# EAGLE design writer_attiny10 (EAGLE 6.1)
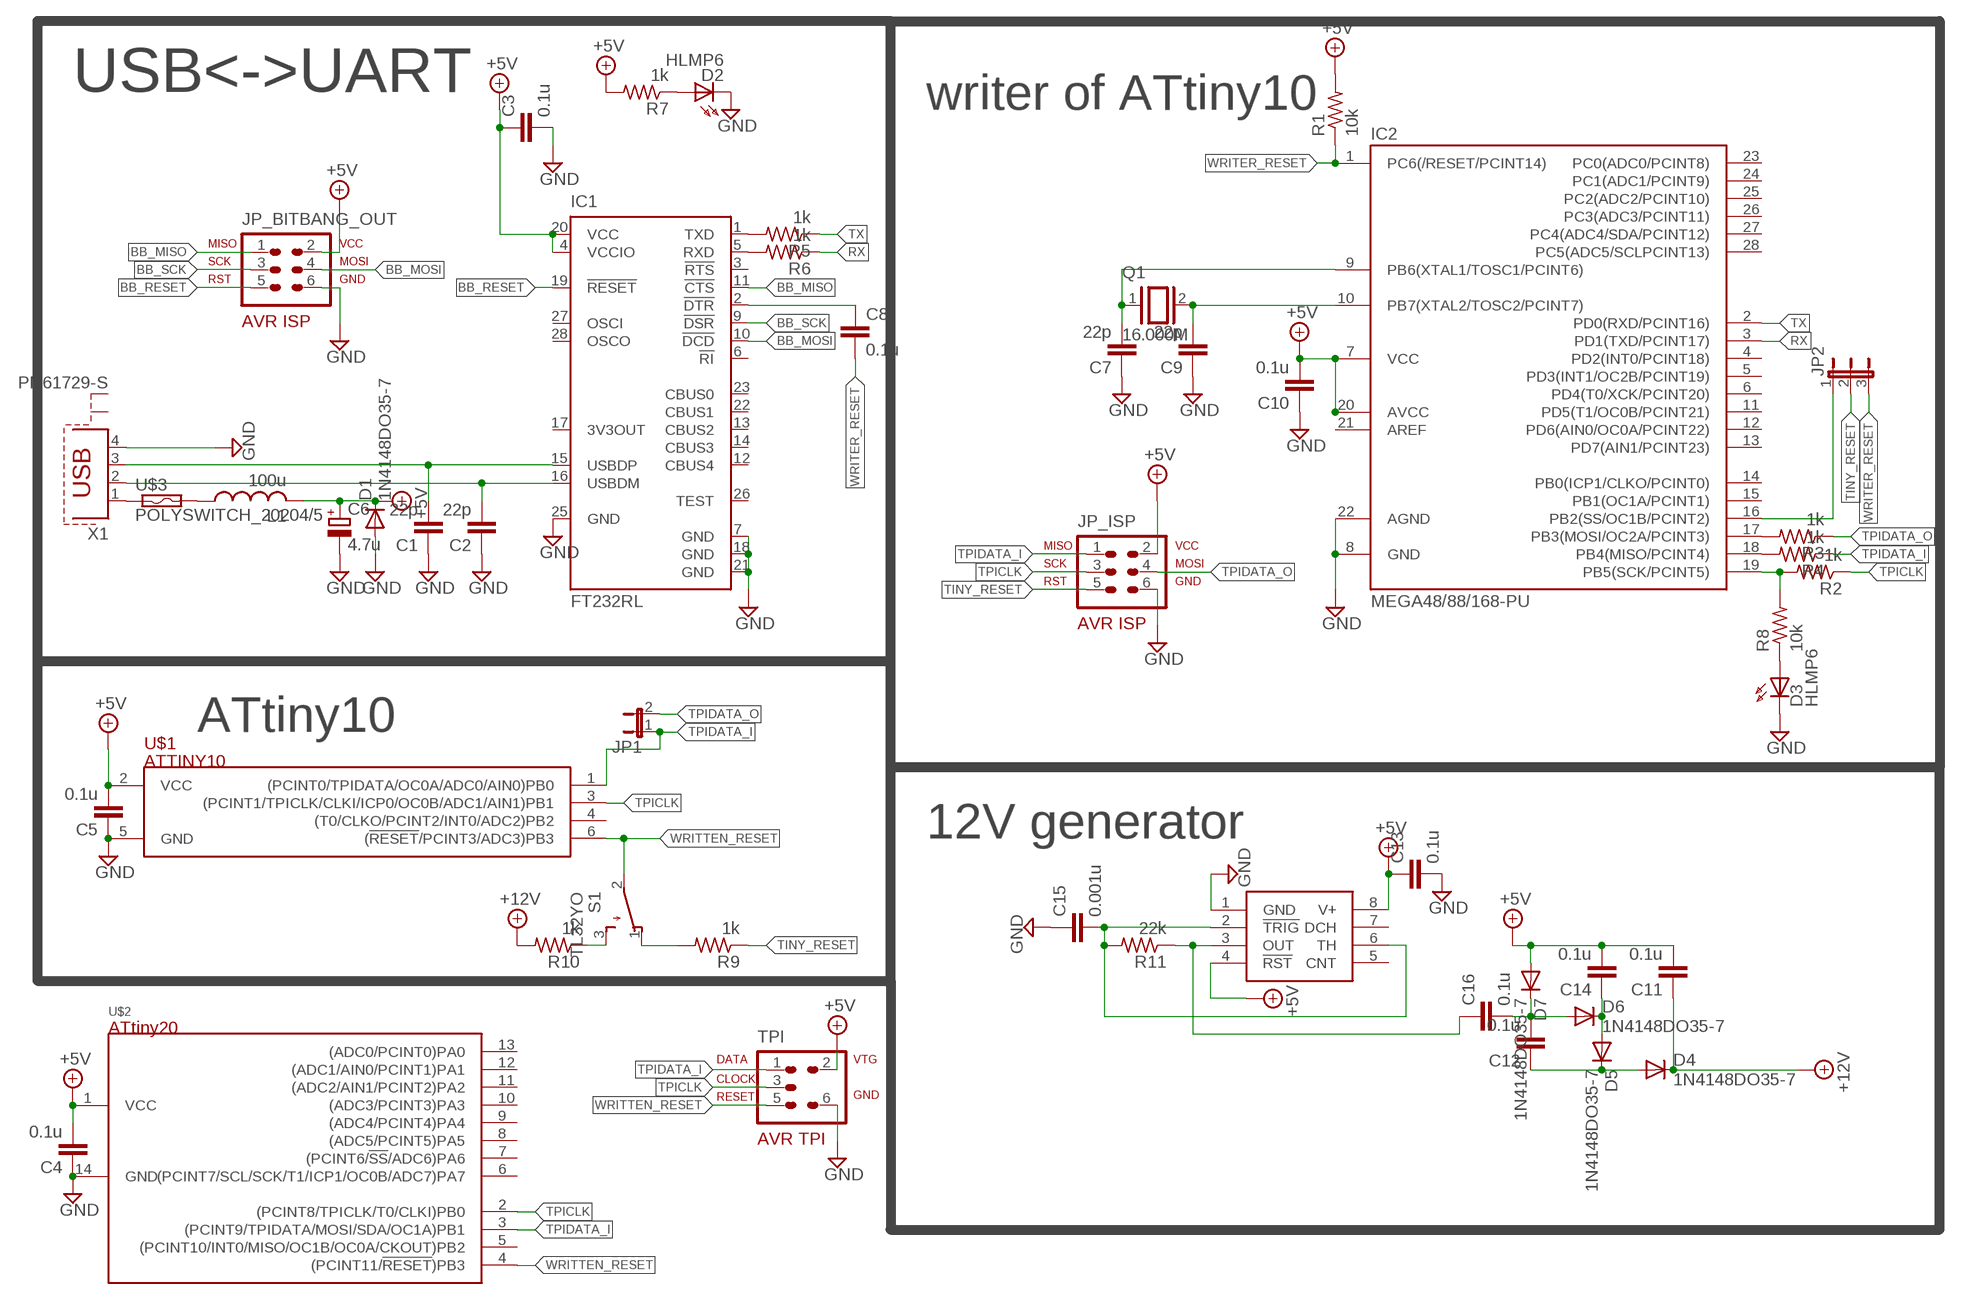
[diagram p0: schematic, sheet 1]

## Parts
C1  22p  C-EUC0603  [C0603]
C2  22p  C-EUC0603  [C0603]
C3  0.1u  C-EUC0603  [C0603]
C4  0.1u  C-EUC0603  [C0603]
C5  0.1u  C-EUC0603  [C0603]
C6  4.7u  CPOL-EUCT3216  [CT3216]
C7  22p  C-EUC0603  [C0603]
C8  0.1u  C-EUC0603  [C0603]
C9  22p  C-EUC0603  [C0603]
C10  0.1u  C-EUC0603  [C0603]
C11  0.1u  C-EUC0603  [C0603]
C12  0.1u  C-EUC0603  [C0603]
C13  0.1u  C-EUC0603  [C0603]
C14  0.1u  C-EUC0603  [C0603]
C15  0.001u  C-EUC0603  [C0603]
C16  0.1u  C-EUC0603  [C0603]
D1  1N4148DO35-7  [DO35-7]
D2  HLMP6  [HLMP6]
D3  HLMP6  [HLMP6]
D4  1N4148DO35-7  [DO35-7]
D5  1N4148DO35-7  [DO35-7]
D6  1N4148DO35-7  [DO35-7]
D7  1N4148DO35-7  [DO35-7]
IC1  FT232RL  [SSOP28]
IC2  MEGA48/88/168-PU  [DIL28-3]
IC3  LMC555  [DIL08]
JP1  JP1E  [JP1]
JP2  JP2E  [JP2]
JP_BITBANG_OUT  AVR-ISP-6VERT  [AVR-ISP-6]
JP_ISP  AVR-ISP-6VERT  [AVR-ISP-6]
L1  100u  L-US0207/10  [0207/10]
Q1  16.000M  XTAL/S  [QS]
R1  10k  R-US_R0603  [R0603]
R2  1k  R-US_R0603  [R0603]
R3  1k  R-US_R0603  [R0603]
R4  1k  R-US_R0603  [R0603]
R5  1k  R-US_R0603  [R0603]
R6  1k  R-US_R0603  [R0603]
R7  1k  R-US_R0603  [R0603]
R8  10k  R-US_R0603  [R0603]
R9  1k  R-US_R0603  [R0603]
R10  1k  R-US_R0603  [R0603]
R11  22k  R-US_R0603  [R0603]
S1  TL32YO  [TL3XYO]
TPI  AVR-TPIVERT  [AVR-ISP-6]
U$1  ATTINY10  [SOT-23]
U$2  ATTINY20  [SOIC14]
U$3  POLYSWITCH_20204/5  [0204/5]
X1  PN61729-S  [PN61729-S]

## Nets
+5V [pwr]: C3.1 C4.2 C5.2 C6.+ C10.2 C11.2 C13.1 C14.2 D1.C D7.A IC1.4(VCCIO) IC1.20(VCC) IC2.7(VCC) IC2.20(AVCC) IC3.4(!RST) IC3.8(V+) JP_BITBANG_OUT.2 JP_ISP.2 L1.2 R1.2 R7.2 TPI.2 U$1.2(VCC) U$2.1(VCC)
+12V: C11.1 D4.C R10.2
BB_MISO: IC1.11(!CTS) JP_BITBANG_OUT.1
BB_MOSI: IC1.10(!DCD) JP_BITBANG_OUT.4
BB_RESET: IC1.19(!RESET) JP_BITBANG_OUT.5
BB_SCK: IC1.9(!DSR) JP_BITBANG_OUT.3
GND: C1.1 C2.1 C3.2 C4.1 C5.1 C6.- C7.1 C9.1 C10.1 C13.2 C15.1 D1.A D2.K D3.K IC1.7(GND) IC1.18(GND) IC1.21(GND) IC1.25(GND) IC2.8(GND) IC2.22(AGND) IC3.1(GND) JP_BITBANG_OUT.6 JP_ISP.6 TPI.6 U$1.5(GND) U$2.14(GND) X1.4
N$1: C2.2 IC1.16(USBDM) X1.2
N$2: C1.2 IC1.15(USBDP) X1.3
N$3 [pwr]: U$3.1 X1.1
N$4: C7.2 IC2.9(PB6(XTAL1/TOSC1/PCINT6)) Q1.1
N$5: C9.2 IC2.10(PB7(XTAL2/TOSC2/PCINT7)) Q1.2
N$6: IC2.18(PB4(MISO/PCINT4)) R4.2
N$7: D2.A R7.1
N$8: D3.A R8.1
N$9: IC1.5(RXD) R6.2
N$10: C12.2 C16.2 D6.A D7.C
N$11: IC1.1(TXD) R5.2
N$12: C15.2 IC3.2(!TRIG) IC3.6(TH) R11.2
N$13: C16.1 IC3.3(OUT) R11.1
N$14: C14.1 D5.A D6.C
N$15: C12.1 D4.A D5.C
N$16: R10.1 S1.3(S)
N$17: R9.2 S1.1(O)
N$18 [pwr]: L1.1 U$3.2
N$19: IC2.17(PB3(MOSI/OC2A/PCINT3)) R3.2
N$20: IC2.16(PB2(SS/OC1B/PCINT2)) JP2.1
N$21: C8.1 IC1.2(!DTR)
N$22: IC2.19(PB5(SCK/PCINT5)) R2.2 R8.2
RX: IC2.3(PD1(TXD/PCINT17)) R6.1
TINY_RESET: JP2.2 JP_ISP.5 R9.1
TPICLK: JP_ISP.3 R2.1 TPI.3 U$1.3((PCINT1/TPICLK/CLKI/ICP0/OC0B/ADC1/AIN1)PB1) U$2.2((PCINT8/TPICLK/T0/CLKI)PB0)
TPIDATA_I: JP1.1 JP_ISP.1 R4.1 TPI.1 U$1.1((PCINT0/TPIDATA/OC0A/ADC0/AIN0)PB0) U$2.3((PCINT9/TPIDATA/MOSI/SDA/OC1A)PB1)
TPIDATA_O: JP1.2 JP_ISP.4 R3.1
TX: IC2.2(PD0(RXD/PCINT16)) R5.1
WRITER_RESET: C8.2 IC2.1(PC6(/RESET/PCINT14)) JP2.3 R1.1
WRITTEN_RESET: S1.2(P) TPI.5 U$1.6((!RESET!/PCINT3/ADC3)PB3) U$2.4((PCINT11/!RESET!)PB3)
Unconnected: IC1.3(!RTS) IC1.6(!RI) IC1.12(CBUS4) IC1.13(CBUS2) IC1.14(CBUS3) IC1.17(3V3OUT) IC1.22(CBUS1) IC1.23(CBUS0) IC1.26(TEST) IC1.27(OSCI) IC1.28(OSCO) IC2.4(PD2(INT0/PCINT18)) IC2.5(PD3(INT1/OC2B/PCINT19)) IC2.6(PD4(T0/XCK/PCINT20)) IC2.11(PD5(T1/OC0B/PCINT21)) IC2.12(PD6(AIN0/OC0A/PCINT22)) IC2.13(PD7(AIN1/PCINT23)) IC2.14(PB0(ICP1/CLKO/PCINT0)) IC2.15(PB1(OC1A/PCINT1)) IC2.21(AREF) IC2.23(PC0(ADC0/PCINT8)) IC2.24(PC1(ADC1/PCINT9)) IC2.25(PC2(ADC2/PCINT10)) IC2.26(PC3(ADC3/PCINT11)) IC2.27(PC4(ADC4/SDA/PCINT12)) IC2.28(PC5(ADC5/SCLPCINT13)) IC3.5(CNT) IC3.7(DCH) U$1.4((T0/CLKO/PCINT2/INT0/ADC2)PB2) U$2.5((PCINT10/INT0/MISO/OC1B/OC0A/CKOUT)PB2) U$2.6((PCINT7/SCL/SCK/T1/ICP1/OC0B/ADC7)PA7) U$2.7((PCINT6/!SS!/ADC6)PA6) U$2.8((ADC5/PCINT5)PA5) U$2.9((ADC4/PCINT4)PA4) U$2.10((ADC3/PCINT3)PA3) U$2.11((ADC2/AIN1/PCINT2)PA2) U$2.12((ADC1/AIN0/PCINT1)PA1) U$2.13((ADC0/PCINT0)PA0) X1.S1 X1.S2

## Notes on the sheet
- USB<->UART
- writer of ATtiny10
- ATtiny10
- 12V generator

## Library data of the parts
C1-C5 C7-C16 = rcl:C-EU: CAPACITOR, European symbol
C6 = rcl:CPOL-EU: POLARIZED CAPACITOR, European symbol
D1 D4-D7 = diode:1N4148: DIODE high speed (Philips)
D2 D3 = display-hp:HLMP6: LED 2mm horizontal; MF: AGILENT TECHNOLOGIES; MPN: HLMP-6500; OC_FARNELL: 1652490; OC_NEWARK: 40K0088
IC1 = ftdichip:FT232R: Source: http://www.ftdichip.com/Documents/DataSheets/DS_FT232R_v104.pdf; MPN: FT232RL; OC_FARNELL: 1146032; OC_NEWARK: 91K9918
IC2 = avr-7:MEGA48/88/168-PU
IC3 = myparts:LMC555
JP1 = jumper:JP1E: JUMPER
JP2 = jumper:JP2E: JUMPER
JP_BITBANG_OUT JP_ISP = avr-7:AVR-ISP-6: AVR ISP-6 Serial Programming Header
L1 = resistor:L-US: INDUCTOR, American symbol
Q1 = special:XTAL/S: CRYSTAL
R1-R11 = resistor:R-US_: RESISTOR, American symbol
S1 = switch:TL32YO: TINY SWITCH ON - MOM Source: http://www2.produktinfo.conrad.com/datenblaetter/700000-724999/705152-da-01-de-Subminiaturschalter_TL_36YO.pdf
TPI = avr-7:AVR-TPI: AVR TPI connector
U$1 = myparts:ATTINY10
U$2 = myparts:ATTINY20; SSU: -SSU
U$3 = myparts:POLYSWITCH_2
X1 = con-berg:PN61729-S: BERG USB connector; OC_FARNELL: unknown; OC_NEWARK: unknown

## Net classes
0 default: width 0.254 mm
1 pwr: width 0.508 mm

## Board
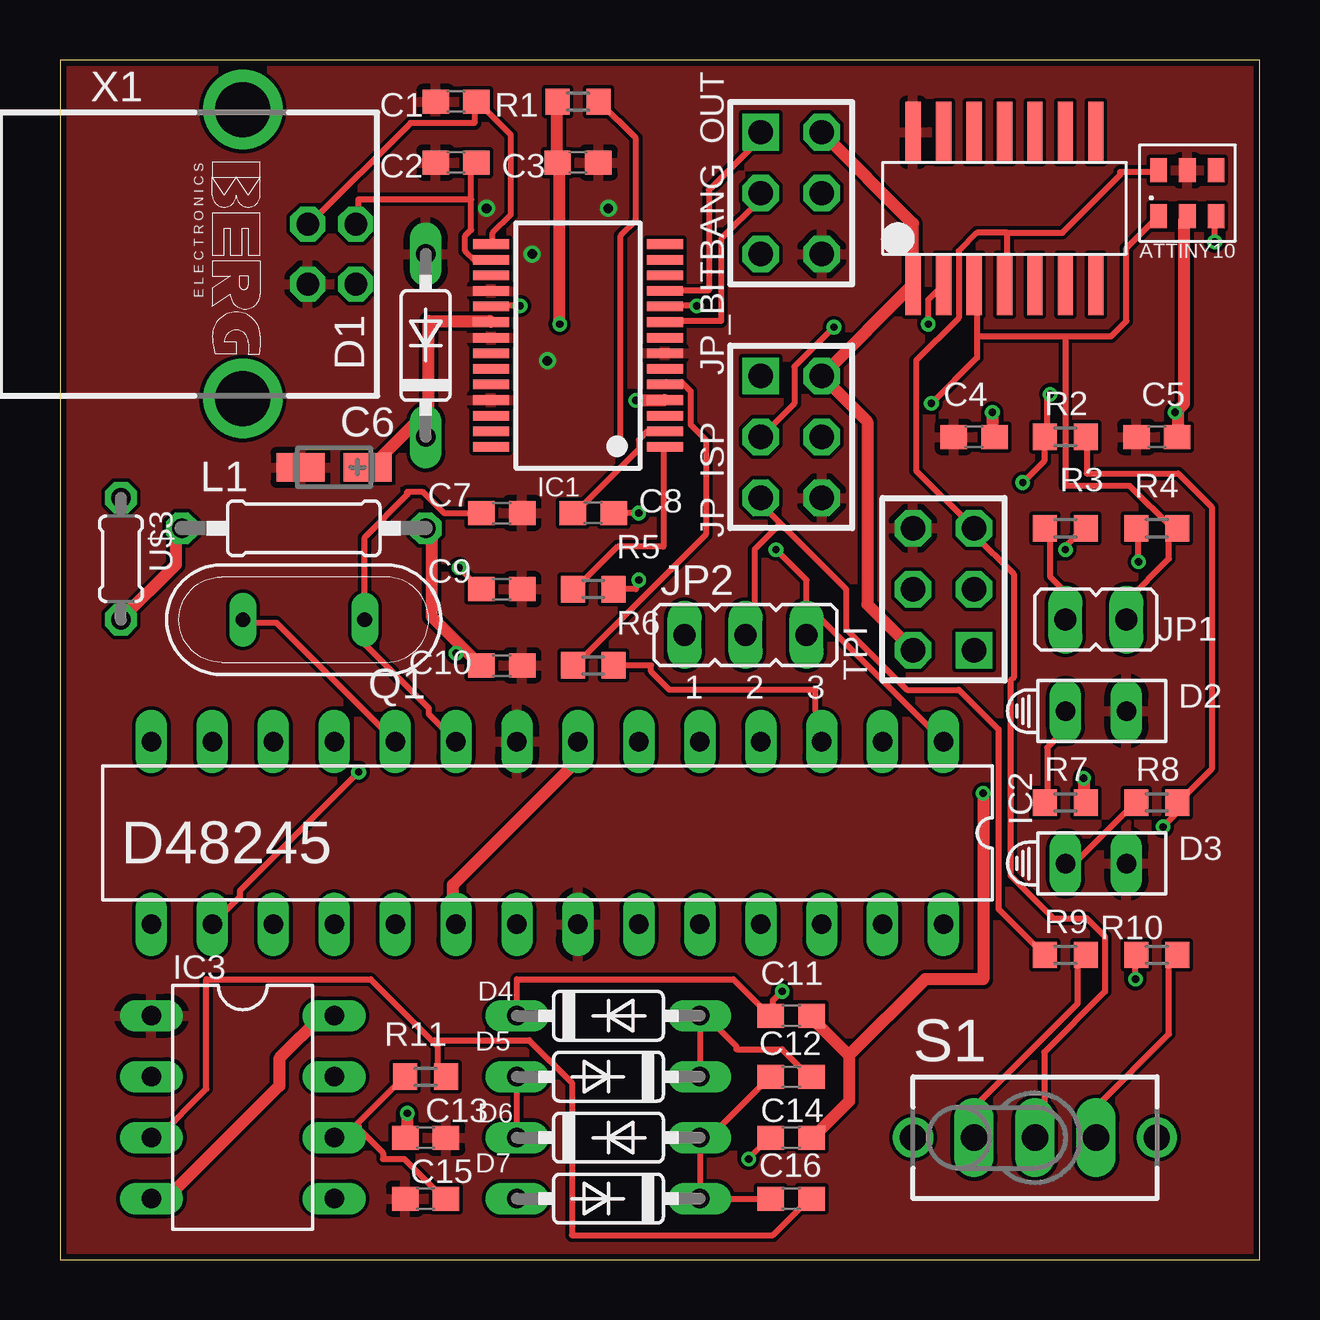
[diagram p1: board, top side]
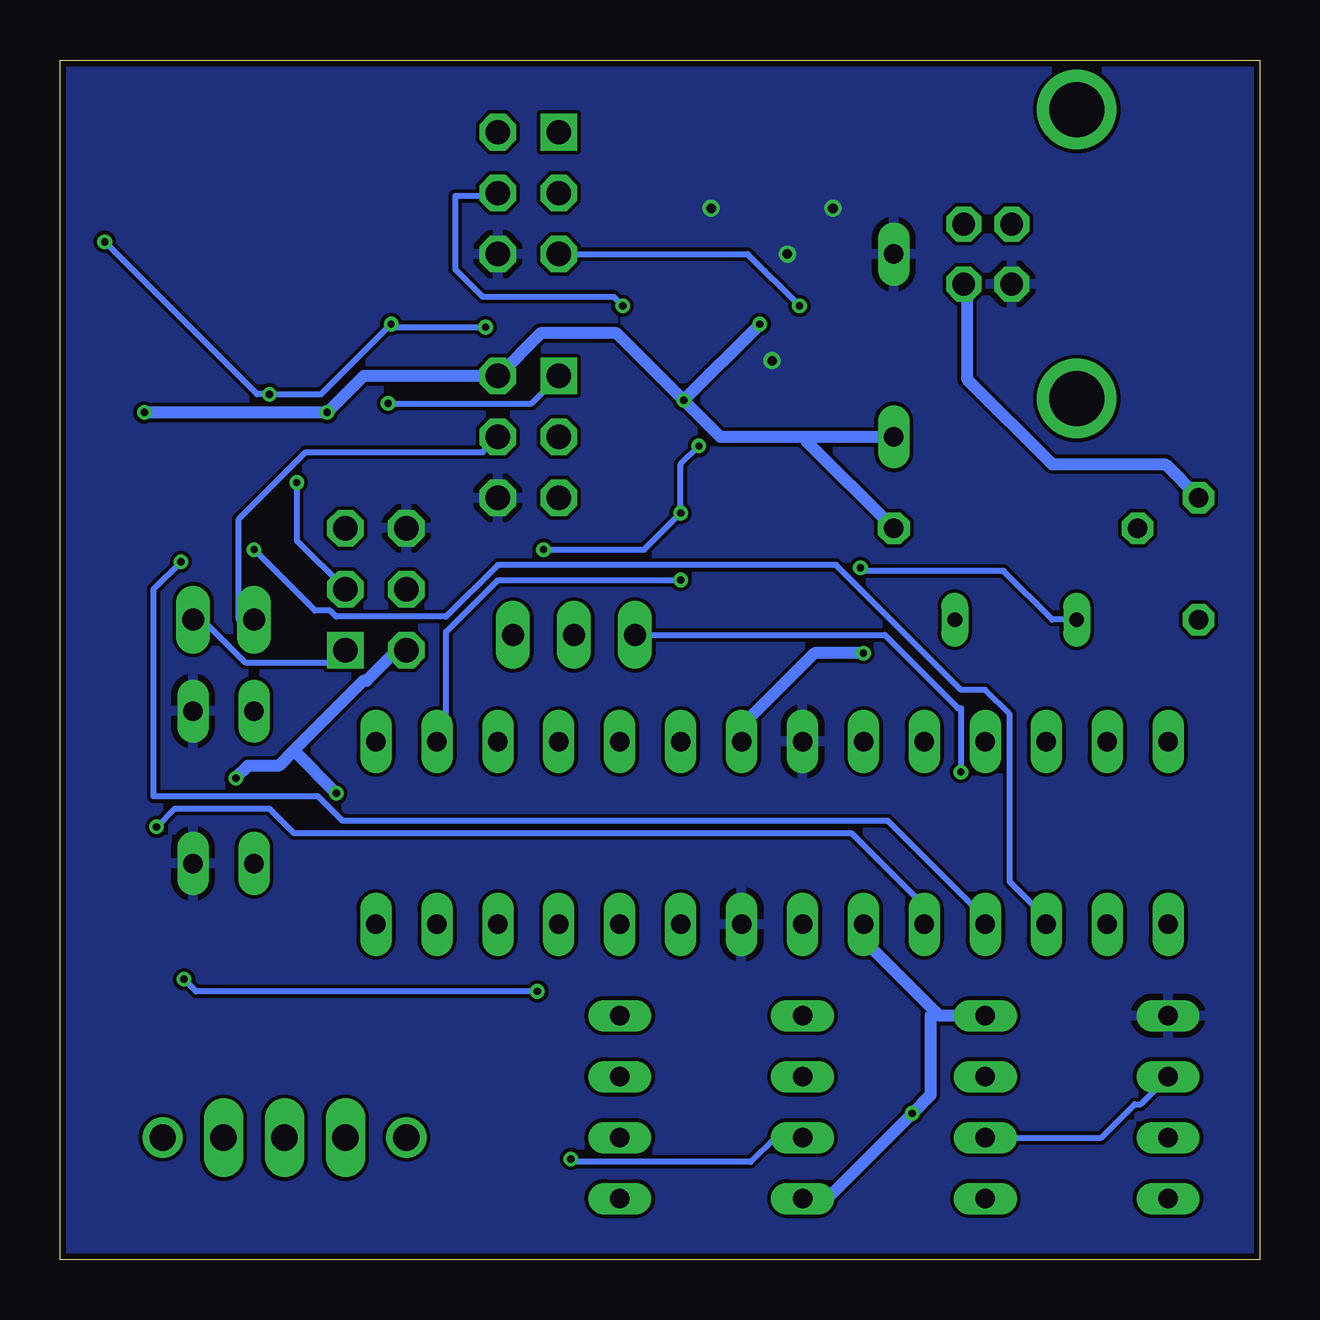
[diagram p2: board, bottom side, seen from below]

Size 50 x 50 mm. Coordinates in mm from the lower left corner, seen from the top.
Outline: 0,0 50,0 50,50 0,50 0,0
Copper layers (1*16): Top 0.035mm / dielectric 1.5mm / Bottom 0.035mm
Design rules: minimum track width 6mil, minimum drill 12mil, track to track 6mil, track to pad 6mil, pad to pad 6mil, via to via 6mil, smd to smd 0mil, copper to edge 10mil, drill to drill 10mil, minimum pad ring 10mil, minimum via ring 6mil, stop-mask expansion 2mil, vias tented up to drill 100mil, thermal gap 10mil

### Footprints (pad centres in the part's own frame; a part is rotated, then mirrored left to right if it is on the bottom)
C0603 = smd 1.1 x 1: 1 -0.85,0; 2 0.85,0
CT3216 = smd 2 x 1.2: + -1.4,0; - 1.4,0
DO35-7 = drill 0.813 long: A 3.81,0; C -3.81,0
HLMP6 = drill 0.813 long: A -1.27,0; K 1.27,0
SSOP28 = smd 0.4 x 1.5: 1 -4.225,-3.625; 2 -3.575,-3.625; 3 -2.925,-3.625; 4 -2.275,-3.625; 5 -1.625,-3.625; 6 -0.975,-3.625; 7 -0.325,-3.625; 8 0.325,-3.625; 9 0.975,-3.625; 10 1.625,-3.625; 11 2.275,-3.625; 12 2.925,-3.625; 13 3.575,-3.625; 14 4.225,-3.625; 15 4.225,3.625; 16 3.575,3.625; 17 2.925,3.625; 18 2.275,3.625; 19 1.625,3.625; 20 0.975,3.625; 21 0.325,3.625; 22 -0.325,3.625; 23 -0.975,3.625; 24 -1.625,3.625; 25 -2.275,3.625; 26 -2.925,3.625; 27 -3.575,3.625; 28 -4.225,3.625
DIL28-3 = drill 0.813 long: 1 -16.51,-3.81; 2 -13.97,-3.81; 3 -11.43,-3.81; 4 -8.89,-3.81; 5 -6.35,-3.81; 6 -3.81,-3.81; 7 -1.27,-3.81; 8 1.27,-3.81; 9 3.81,-3.81; 10 6.35,-3.81; 11 8.89,-3.81; 12 11.43,-3.81; 13 13.97,-3.81; 14 16.51,-3.81; 15 16.51,3.81; 16 13.97,3.81; 17 11.43,3.81; 18 8.89,3.81; 19 6.35,3.81; 20 3.81,3.81; 21 1.27,3.81; 22 -1.27,3.81; 23 -3.81,3.81; 24 -6.35,3.81; 25 -8.89,3.81; 26 -11.43,3.81; 27 -13.97,3.81; 28 -16.51,3.81
DIL08 = drill 0.813 long: 1 -3.81,-3.81; 2 -1.27,-3.81; 3 1.27,-3.81; 4 3.81,-3.81; 5 3.81,3.81; 6 1.27,3.81; 7 -1.27,3.81; 8 -3.81,3.81
JP1 = drill 0.914 long: 1 0,-1.27; 2 0,1.27
JP2 = drill 0.914 long: 1 -2.54,0; 2 0,0; 3 2.54,0
AVR-ISP-6 = drill 1.016 square: 1 -2.54,-1.27 | drill 1.016 octagon: 2 -2.54,1.27; 3 0,-1.27; 4 0,1.27; 5 2.54,-1.27; 6 2.54,1.27
0207/10 = drill 0.813 octagon: 1 -5.08,0; 2 5.08,0
QS = drill 0.61 long: 1 -2.54,0; 2 2.54,0
R0603 = smd 1 x 1.1: 1 -0.85,0; 2 0.85,0
TL3XYO = drill 1.1 pad 1.422 long: 1 -2.54,0; 2 0,0; 3 2.54,0 | drill 1.1 pad 1.676: M1 -5.08,0; M2 5.08,0
SOT-23 = smd 0.7 x 1: 1 -1.2,-0.95; 2 0,-0.95; 3 1.2,-0.95; 4 1.2,0.95; 5 0,0.95; 6 -1.2,0.95
SOIC14 = smd 2.54 x 0.635: 1 -2.54,3.81; 2 -2.54,2.54; 3 -2.54,1.27; 4 -2.54,0; 5 -2.54,-1.27; 6 -2.54,-2.54; 7 -2.54,-3.81; 8 3.81,-3.81; 9 3.81,-2.54; 10 3.81,-1.27; 11 3.81,0; 12 3.81,1.27; 13 3.81,2.54; 14 3.81,3.81
0204/5 = drill 0.813 octagon: 1 -2.54,0; 2 2.54,0
PN61729-S = drill 0.95 octagon: 1 1.25,4.71; 2 -1.25,4.71; 3 -1.25,2.71; 4 1.25,2.71 | drill 2.3 pad 2.9: S1 -6.02,0; S2 6.02,0

### Placement (x,y rotation side)
C1  16.51,48.26 0 top
C2  16.51,45.72 0 top
C3  21.59,45.72 0 top
C4  38.1,34.29 0 top
C5  45.72,34.29 0 top
C6  11.43,33.02 180 top
C7  18.41,31.11 180 top
C8  22.23,31.11 0 top
C9  18.41,27.94 180 top
C10  18.41,24.77 180 top
C11  30.48,10.16 0 top
C12  30.48,7.62 180 top
C13  15.24,5.08 0 top
C14  30.48,5.08 0 top
C15  15.24,2.54 0 top
C16  30.48,2.54 180 top
D1  15.24,38.1 90 top
D2  43.18,22.86 0 top
D3  43.18,16.51 0 top
D4  22.86,10.16 0 top
D5  22.86,7.62 180 top
D6  22.86,5.08 0 top
D7  22.86,2.54 180 top
IC1  21.59,38.1 90 top
IC2  20.32,17.78 180 top
IC3  7.62,6.35 270 top
JP1  43.18,26.67 90 top
JP2  28.57,26.04 0 top
JP_BITBANG_OUT  30.48,44.45 270 top
JP_ISP  30.48,34.29 270 top
L1  10.16,30.48 0 top
Q1  10.16,26.67 180 top
R1  21.59,48.26 180 top
R2  41.91,34.29 0 top
R3  41.91,30.48 0 top
R4  45.72,30.48 180 top
R5  22.23,27.94 180 top
R6  22.23,24.77 180 top
R7  41.91,19.05 0 top
R8  45.72,19.05 0 top
R9  41.91,12.7 0 top
R10  45.72,12.7 180 top
R11  15.24,7.62 180 top
S1  40.64,5.08 0 top
TPI  36.83,27.94 90 top
U$1  46.99,44.45 0 top
U$2  39.37,43.18 90 top
U$3  2.54,29.21 270 top
X1  7.62,41.91 270 top

### Tracks (layer width: path | path; a pad name or v marks a point on that pad's centre or on a via)
+5V  (via drill 0.3)
  Top 0.508: v14.48,6.1 14.48,5.08 C13.1 | IC3.4 4.83,2.54 4.83,2.92 9.14,7.24 9.14,8.38 10.92,10.16 IC3.8 | IC2.7 21.21,21.21 21.21,20.45 16.38,15.62 16.38,14.1 IC2.20 | 32.89,8.51 32.89,6.6 31.37,5.08 C14.2 | 32.89,8.51 31.37,10.03 31.37,10.16 C11.2 | v42.67,20.07 42.67,19.05 R7.2 | 32.89,8.51 36.07,11.68 38.48,11.68 v38.48,19.43 | 46.61,35.43 46.86,35.69 46.86,43.31 46.99,43.43 U$1.2 | 46.61,35.43 46.61,34.29 C5.2 | v38.86,35.31 38.86,34.29 C4.2 | JP_BITBANG_OUT.2 35.56,43.18 U$2.1 JP_ISP.2 33.66,34.92 33.66,27.3 TPI.2 | v46.48,35.31 46.61,35.43 | 16.76,25.53 15.49,26.8 15.49,29.97 15.24,30.23 L1.2 | 16.76,25.53 17.53,24.77 C10.2 | R1.2 20.7,48.26 20.7,45.72 C3.1 20.83,45.59 v20.83,38.99 | IC1.20 17.91,39.12 15.37,39.12 15.37,34.42 D1.C 15.24,35.31 12.95,33.02 C6.+ | v24,35.81 25.15,35.81 IC1.4 | v16.51,25.27 16.76,25.53
  Bottom 0.508: D7.A 18.03,2.54 v14.48,6.1 13.72,6.86 13.72,10.16 13.59,10.16 13.46,10.29 | IC2.20 16.51,12.95 16.13,12.95 13.46,10.29 | 13.46,10.29 13.34,10.16 IC3.8 | v42.67,20.07 42.16,20.57 40.89,20.57 40.26,21.21 | 40.26,21.21 37.34,24.13 37.21,24.13 35.94,25.4 TPI.2 | 40.26,21.21 v38.48,19.43 | v46.48,35.31 v38.86,35.31 37.34,36.83 JP_ISP.2 29.97,38.61 26.8,38.61 v24,35.81 | v24,35.81 22.48,34.29 18.92,34.29 | D1.C 18.92,34.29 | v24,35.81 v20.83,38.99 | L1.2 18.92,34.16 18.92,34.29 | IC2.7 21.59,22.61 21.21,22.61 18.54,25.27 v16.51,25.27
+12V  (via drill 0.3)
  Top 0.254: D4.C 19.05,11.68 28.07,11.68 29.59,10.16 C11.1 29.72,10.16 29.72,10.79 v30.1,11.18 | v44.83,11.68 44.83,12.7 R10.2
  Bottom 0.254: v44.83,11.68 44.32,11.18 v30.1,11.18
BB_MISO
  Top 0.254: JP_BITBANG_OUT.1 29.21,46.74 27.05,44.58 27.05,40.39 25.27,40.39 IC1.11
BB_MOSI  (via drill 0.3)
  Top 0.254: v26.54,39.75 25.27,39.75 IC1.10
  Bottom 0.254: v26.54,39.75 26.92,40.13 32.38,40.13 33.53,41.27 33.53,44.32 31.88,44.32 JP_BITBANG_OUT.4
BB_RESET  (via drill 0.3)
  Top 0.254: v19.18,39.75 18.03,39.75 IC1.19
  Bottom 0.254: v19.18,39.75 21.34,41.91 JP_BITBANG_OUT.5
BB_SCK
  Top 0.254: JP_BITBANG_OUT.3 29.21,44.2 27.56,42.55 27.56,39.12 25.27,39.12 IC1.9
GND  (via drill 0.4)
  other vias: 17.78,43.81 22.86,43.81 20.32,37.47 19.68,41.91
  pour Top: -2.54,53.34 -2.54,-2.54 54.61,-2.54 54.61,53.34
  pour Bottom: -1.27,52.07 -1.27,-1.27 52.07,-1.27 52.07,52.07 0,52.07
N$1
  Top 0.254: 17.14,44.2 17.14,42.93 16.89,42.67 16.89,42.04 17.27,41.66 17.91,41.66 IC1.16 | 17.14,44.2 17.14,45.59 17.27,45.72 C2.2 | 17.14,44.2 12.45,44.2 12.45,43.18 X1.2
N$2
  Top 0.254: IC1.15 18.03,42.42 18.03,42.8 18.8,43.56 18.8,46.86 17.4,48.26 C1.2 17.27,48.26 17.27,47.37 14.61,47.37 10.41,43.18 X1.3
N$3
  Bottom 0.508: U$3.1 3.94,33.15 8.64,33.15 12.19,36.7 12.19,40.64 12.32,40.64 X1.1
N$4
  Top 0.254: C7.2 16,31.11 15.11,32 14.48,32 14.48,31.88 12.7,30.1 Q1.1 12.57,26.54 12.57,25.78 15.37,22.99 15.37,22.73 IC2.9
N$5  (via drill 0.3)
  Top 0.254: v16.64,28.83 17.53,27.94 C9.2 | IC2.10 9.02,26.54 7.62,26.54 Q1.2
  Bottom 0.254: v16.64,28.83 16.51,28.7 10.67,28.7 8.64,26.67 Q1.2
N$6  (via drill 0.3)
  Top 0.254: v44.96,29.08 44.96,30.48 R4.2
  Bottom 0.254: v44.96,29.08 46.1,27.94 46.1,19.3 39.24,19.3 38.23,18.29 15.49,18.29 11.43,14.22 IC2.18
N$7
  Top 0.254: D2.A 41.91,22.1 41.15,21.34 41.15,19.05 R7.1
N$8
  Top 0.254: D3.A 42.29,16.51 44.83,19.05 R8.1
N$9
  Top 0.254: R6.2 21.46,24.77 26.92,30.23 26.92,34.16 26.29,34.8 26.29,36.2 25.91,36.58 25.27,36.58 IC1.5
N$10
  Top 0.254: C16.2 D7.C D6.A 27.05,5.08 29.59,7.62 C12.2
N$11
  Top 0.254: R5.2 21.46,27.94 23.24,29.72 25.15,29.72 25.15,33.78 IC1.1
N$12
  Top 0.254: R11.2 14.35,7.62 11.81,5.08 IC3.6 12.45,5.59 12.45,5.46 13.46,4.45 13.46,4.19 14.35,4.19 16,2.54 C15.2
  Bottom 0.254: IC3.2 4.95,6.48 5.21,6.48 6.6,5.08 IC3.6
N$13
  Top 0.254: 15.56,9.08 12.95,11.68 6.1,11.68 6.1,7.11 4.06,5.08 IC3.3 | 15.56,9.08 15.75,8.89 15.75,7.87 16,7.62 R11.1 | C16.1 31.24,2.54 29.72,1.02 21.34,1.02 21.34,7.37 19.56,9.14 15.62,9.14 15.56,9.08
N$14  (via drill 0.3)
  Top 0.254: v28.7,4.19 29.59,5.08 C14.1 | D6.C D5.A
  Bottom 0.254: v28.7,4.19 28.57,4.06 21.21,4.06 20.19,5.08 D6.C
N$15
  Top 0.254: C12.1 31.24,7.62 30.1,8.76 28.19,8.76 28.19,8.89 26.92,10.16 D4.A D5.C
N$16
  Top 0.254: S1.3 43.18,6.35 46.23,9.4 46.23,12.45 46.48,12.7 R10.1
N$17
  Top 0.254: S1.1 38.1,6.35 42.42,10.67 42.42,12.45 42.67,12.7 R9.2
N$18
  Top 0.508: U$3.2 4.83,28.96 4.83,29.97 5.08,30.23 L1.1
N$19  (via drill 0.3)
  Top 0.254: v41.91,29.59 41.91,29.72 42.67,30.48 R3.2
  Bottom 0.254: v41.91,29.59 39.37,27.05 38.73,27.05 38.48,26.8 33.91,26.8 31.75,28.96 17.65,28.96 12.45,23.75 11.43,23.75 10.41,22.73 10.41,15.75 8.89,14.22 IC2.17
N$20  (via drill 0.3)
  Top 0.254: IC2.16 7.49,15.11 7.49,15.37 v12.45,20.32
  Bottom 0.254: v12.45,20.32 12.45,22.99 12.57,22.99 15.62,26.04 JP2.1
N$21
  Top 0.254: C8.1 21.46,31.11 24.13,33.78 24.13,34.16 24.51,34.54 25.15,34.54 IC1.2
N$22  (via drill 0.3)
  Top 0.254: R2.2 42.8,34.29 42.8,32.77 46.61,32.77 48.01,31.37 48.01,20.45 46.61,19.05 R8.2 46.48,19.05 46.48,18.54 v45.97,18.03
  Bottom 0.254: IC2.19 13.97,15.11 14.35,15.11 17.02,17.78 40.26,17.78 41.27,18.8 45.21,18.8 v45.97,18.03
RX
  Top 0.254: R6.1 24.64,24.77 24.64,24.51 25.4,23.75 31.5,23.75 31.5,22.86 31.75,22.61 IC2.3
TINY_RESET
  Top 0.254: 30.04,30.67 29.21,31.5 JP_ISP.5 | 30.04,30.67 32.77,27.94 32.77,26.29 35.31,23.75 37.47,23.75 39.12,22.1 39.12,14.61 41.02,12.7 R9.1 | JP2.2 28.96,26.42 28.96,29.59 30.04,30.67
TPICLK  (via drill 0.3)
  Top 0.254: v48.13,42.42 48.13,43.43 U$1.3 | v41.27,36.07 41.15,35.94 41.15,34.29 R2.1 41.02,34.29 41.02,33.27 v40.13,32.38 | U$2.2 36.2,40.01 v36.2,38.99 | JP_ISP.3 30.61,35.69 30.61,37.21 v32.26,38.86
  Bottom 0.254: v48.13,42.42 41.78,36.07 v41.27,36.07 39.12,36.07 v36.2,38.99 36.2,38.86 v32.26,38.86 | TPI.3 40.13,29.97 v40.13,32.38
TPIDATA_I  (via drill 0.3)
  Top 0.254: JP1.1 44.45,27.43 46.23,29.21 46.23,30.23 46.48,30.48 R4.1 46.35,30.48 44.58,32.26 41.91,32.26 41.91,38.48 | 38.23,38.48 41.91,38.48 | 41.91,38.48 43.81,38.48 44.45,39.12 44.45,42.16 45.72,43.43 U$1.1 | 38.23,38.48 38.23,40.51 U$2.3 | v36.32,35.69 38.23,37.59 38.23,38.48
  Bottom 0.254: TPI.1 38.61,24.89 42.29,24.89 44.07,26.67 JP1.1 | JP_ISP.1 30.35,35.69 v36.32,35.69
TPIDATA_O
  Top 0.254: JP1.2 41.91,27.81 41.27,28.45 41.27,30.35 41.15,30.48 R3.1
  Bottom 0.254: JP_ISP.4 32.38,33.66 39.75,33.66 42.55,30.86 42.55,26.67 JP1.2
TX  (via drill 0.3)
  Top 0.254: R5.1 24,27.94 24,28.19 v24.13,28.32
  Bottom 0.254: v24.13,28.32 31.75,28.32 33.91,26.16 33.91,21.59 IC2.2
WRITER_RESET  (via drill 0.3)
  Top 0.254: v24.13,31.11 C8.2 | v29.84,29.59 31.11,28.32 31.11,27.3 | v23.37,33.91 23.37,42.67 24,43.31 24,46.74 22.48,48.26 R1.1 | 31.11,27.3 IC2.1 | 31.11,27.3 JP2.3
  Bottom 0.254: v29.84,29.59 25.65,29.59 v24.13,31.11 24.13,33.15 v23.37,33.91
WRITTEN_RESET
  Top 0.254: 39.5,42.8 41.78,42.8 44.2,45.21 44.2,45.34 45.72,45.34 U$1.6 | 39.5,42.8 39.5,40.77 U$2.4 | 39.5,42.8 38.23,42.8 37.47,42.04 37.47,39.24 35.69,37.47 35.69,32.89 TPI.5 38.1,30.23 39.75,28.57 39.75,24.26 39.62,24.13 39.62,16 41.4,14.22 42.8,14.22 43.56,13.46 43.56,11.18 41.02,8.64 41.02,5.46 S1.2

### Text on the board
tNames: D48245